# Altium schematic sheet Pg14_FPGA_DDR3.SchDoc: FPGA MEMORY -DDR2
size A2; DocumentNumber: 14; SheetNumber: 14; SheetTotal: 16
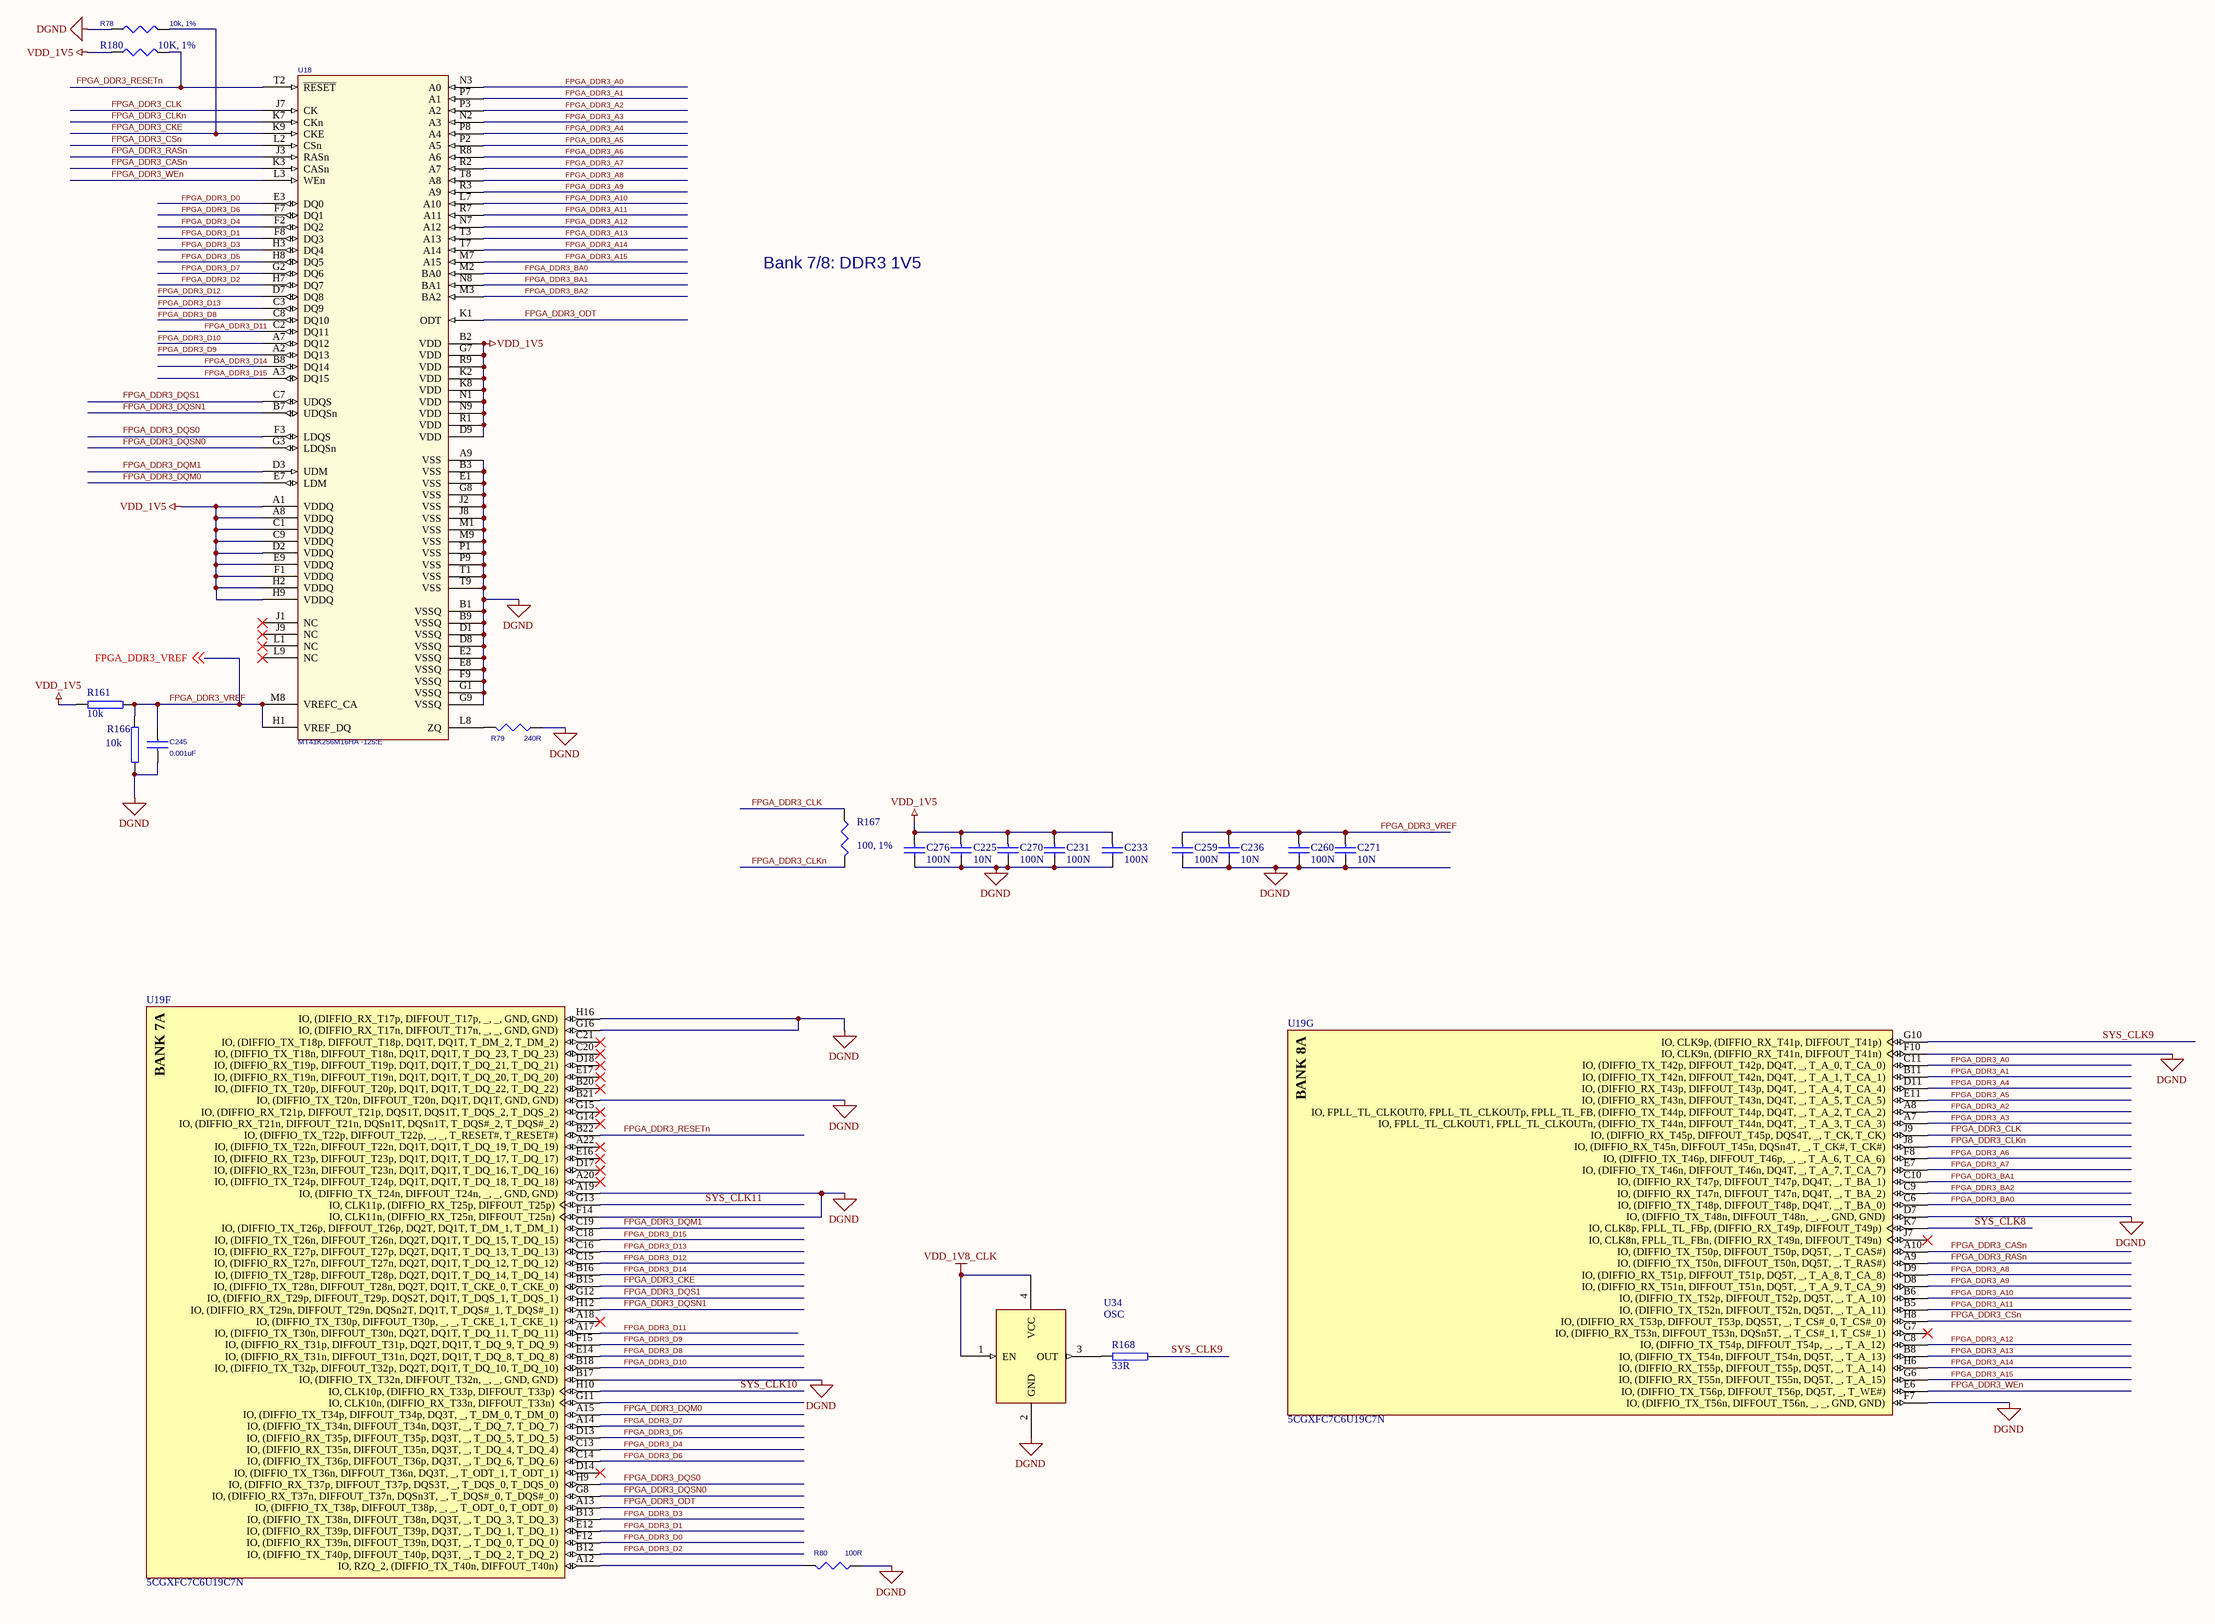
[diagram p0: Pg14_FPGA_DDR3.SchDoc]

## Parts
?  (no value)  (graphical)
C225  10N  [sc0402]
C231  100N  [sc0402]
C233  100N  [sc0402]
C236  10N  [sc0402]
C245  0.001uF  [SM-7351-CAP-0402]
C259  100N  [sc0402]
C260  100N  [0603]
C270  100N  [sc0402]
C271  10N  [sc0402]
C276  100N  [sc0402]
R78  10k, 1%  [sm-7351-res-0402 - duplicate]
R79  240R  [SM-7351-RES-0402]
R80  100R  [SM-7351-RES-0402]
R161  10k  [0603]
R166  10k  [0603]
R167  100, 1%  [sc0402]
R168  33R  [sc0402]
R180  10K, 1%  [sc0402]
U18  MT41K256M16HA -125:E  [BGA14X10-96]
U19  5CGXFC7C6U19C7N  [ALTR-UBGA484_A-190]  (parts F,G of 13)
U34  OSC  [Osc 3.2x2.5]

## Nets
DGND: C225.2 C231.2 C233.2 C236.2 C245.2 C259.2 C260.2 C270.2 C271.2 C276.2 R78.1 R79.2(P2) R80.2(P2) R166.2 U18.A9(VSS) U18.B1(VSSQ) U18.B3(VSS) U18.B9(VSSQ) U18.D1(VSSQ) U18.D8(VSSQ) U18.E1(VSS) U18.E2(VSSQ) U18.E8(VSSQ) U18.F9(VSSQ) U18.G1(VSSQ) U18.G8(VSS) U18.G9(VSSQ) U18.J2(VSS) U18.J8(VSS) U18.M1(VSS) U18.M9(VSS) U18.P1(VSS) U18.P9(VSS) U18.T1(VSS) U18.T9(VSS) U19.A19(IO,_(DIFFIO_TX_T24n,_DIFFOUT_T24n,__,__,_GND,_GND)) U19.B17(IO,_(DIFFIO_TX_T32n,_DIFFOUT_T32n,__,__,_GND,_GND)) U19.B21(IO,_(DIFFIO_TX_T20n,_DIFFOUT_T20n,_DQ1T,_DQ1T,_GND,_GND)) U19.D7(IO,_(DIFFIO_TX_T48n,_DIFFOUT_T48n,__,__,_GND,_GND)) U19.F7(IO,_(DIFFIO_TX_T56n,_DIFFOUT_T56n,__,__,_GND,_GND)) U19.F10(IO,_CLK9n,_(DIFFIO_RX_T41n,_DIFFOUT_T41n)) U19.F14(IO,_CLK11n,_(DIFFIO_RX_T25n,_DIFFOUT_T25n)) U19.G16(IO,_(DIFFIO_RX_T17n,_DIFFOUT_T17n,__,__,_GND,_GND)) U19.H16(IO,_(DIFFIO_RX_T17p,_DIFFOUT_T17p,__,__,_GND,_GND)) U34.2(GND)
VDD_1V5: C225.1 C231.1 C233.1 C270.1 C276.1 R161.1 R180.1 U18.A1(VDDQ) U18.A8(VDDQ) U18.B2(VDD) U18.C1(VDDQ) U18.C9(VDDQ) U18.D2(VDDQ) U18.D9(VDD) U18.E9(VDDQ) U18.F1(VDDQ) U18.G7(VDD) U18.H2(VDDQ) U18.H9(VDDQ) U18.K2(VDD) U18.K8(VDD) U18.N1(VDD) U18.N9(VDD) U18.R1(VDD) U18.R9(VDD)
VDD_1V8_CLK: U34.1(EN) U34.4(VCC)
FPGA_DDR3_A0: U18.N3(A0) U19.C11(IO,_(DIFFIO_TX_T42p,_DIFFOUT_T42p,_DQ4T,__,_T_A_0,_T_CA_0))
FPGA_DDR3_A1: U18.P7(A1) U19.B11(IO,_(DIFFIO_TX_T42n,_DIFFOUT_T42n,_DQ4T,__,_T_A_1,_T_CA_1))
FPGA_DDR3_A2: U18.P3(A2) U19.A8(IO,_FPLL_TL_CLKOUT0,_FPLL_TL_CLKOUTp,_FPLL_TL_FB,_(DIFFIO_TX_T44p,_DIFFOUT_T44p,_DQ4T,__,_T_A_2,_T_CA_2))
FPGA_DDR3_A3: U18.N2(A3) U19.A7(IO,_FPLL_TL_CLKOUT1,_FPLL_TL_CLKOUTn,_(DIFFIO_TX_T44n,_DIFFOUT_T44n,_DQ4T,__,_T_A_3,_T_CA_3))
FPGA_DDR3_A4: U18.P8(A4) U19.D11(IO,_(DIFFIO_RX_T43p,_DIFFOUT_T43p,_DQ4T,__,_T_A_4,_T_CA_4))
FPGA_DDR3_A5: U18.P2(A5) U19.E11(IO,_(DIFFIO_RX_T43n,_DIFFOUT_T43n,_DQ4T,__,_T_A_5,_T_CA_5))
FPGA_DDR3_A6: U18.R8(A6) U19.F8(IO,_(DIFFIO_TX_T46p,_DIFFOUT_T46p,__,__,_T_A_6,_T_CA_6))
FPGA_DDR3_A7: U18.R2(A7) U19.E7(IO,_(DIFFIO_TX_T46n,_DIFFOUT_T46n,_DQ4T,__,_T_A_7,_T_CA_7))
FPGA_DDR3_A8: U18.T8(A8) U19.D9(IO,_(DIFFIO_RX_T51p,_DIFFOUT_T51p,_DQ5T,__,_T_A_8,_T_CA_8))
FPGA_DDR3_A9: U18.R3(A9) U19.D8(IO,_(DIFFIO_RX_T51n,_DIFFOUT_T51n,_DQ5T,__,_T_A_9,_T_CA_9))
FPGA_DDR3_A10: U18.L7(A10) U19.B6(IO,_(DIFFIO_TX_T52p,_DIFFOUT_T52p,_DQ5T,__,_T_A_10))
FPGA_DDR3_A11: U18.R7(A11) U19.B5(IO,_(DIFFIO_TX_T52n,_DIFFOUT_T52n,_DQ5T,__,_T_A_11))
FPGA_DDR3_A12: U18.N7(A12) U19.C8(IO,_(DIFFIO_TX_T54p,_DIFFOUT_T54p,__,__,_T_A_12))
FPGA_DDR3_A13: U18.T3(A13) U19.B8(IO,_(DIFFIO_TX_T54n,_DIFFOUT_T54n,_DQ5T,__,_T_A_13))
FPGA_DDR3_A14: U18.T7(A14) U19.H6(IO,_(DIFFIO_RX_T55p,_DIFFOUT_T55p,_DQ5T,__,_T_A_14))
FPGA_DDR3_A15: U18.M7(A15) U19.G6(IO,_(DIFFIO_RX_T55n,_DIFFOUT_T55n,_DQ5T,__,_T_A_15))
FPGA_DDR3_BA0: U18.M2(BA0) U19.C6(IO,_(DIFFIO_TX_T48p,_DIFFOUT_T48p,_DQ4T,__,_T_BA_0))
FPGA_DDR3_BA1: U18.N8(BA1) U19.C10(IO,_(DIFFIO_RX_T47p,_DIFFOUT_T47p,_DQ4T,__,_T_BA_1))
FPGA_DDR3_BA2: U18.M3(BA2) U19.C9(IO,_(DIFFIO_RX_T47n,_DIFFOUT_T47n,_DQ4T,__,_T_BA_2))
FPGA_DDR3_CASn: U18.K3(CASn) U19.A10(IO,_(DIFFIO_TX_T50p,_DIFFOUT_T50p,_DQ5T,__,_T_CAS#))
FPGA_DDR3_CKE: R78.2 U18.K9(CKE) U19.B15(IO,_(DIFFIO_TX_T28n,_DIFFOUT_T28n,_DQ2T,_DQ1T,_T_CKE_0,_T_CKE_0))
FPGA_DDR3_CLK: R167.1 U18.J7(CK) U19.J9(IO,_(DIFFIO_RX_T45p,_DIFFOUT_T45p,_DQS4T,__,_T_CK,_T_CK))
FPGA_DDR3_CLKn: R167.2 U18.K7(CKn) U19.J8(IO,_(DIFFIO_RX_T45n,_DIFFOUT_T45n,_DQSn4T,__,_T_CK#,_T_CK#))
FPGA_DDR3_CSn: U18.L2(CSn) U19.H8(IO,_(DIFFIO_RX_T53p,_DIFFOUT_T53p,_DQS5T,__,_T_CS#_0,_T_CS#_0))
FPGA_DDR3_D0: U18.E3(DQ0) U19.F12(IO,_(DIFFIO_RX_T39n,_DIFFOUT_T39n,_DQ3T,__,_T_DQ_0,_T_DQ_0))
FPGA_DDR3_D1: U18.F8(DQ3) U19.E12(IO,_(DIFFIO_RX_T39p,_DIFFOUT_T39p,_DQ3T,__,_T_DQ_1,_T_DQ_1))
FPGA_DDR3_D2: U18.H7(DQ7) U19.B12(IO,_(DIFFIO_TX_T40p,_DIFFOUT_T40p,_DQ3T,__,_T_DQ_2,_T_DQ_2))
FPGA_DDR3_D3: U18.H3(DQ4) U19.B13(IO,_(DIFFIO_TX_T38n,_DIFFOUT_T38n,_DQ3T,__,_T_DQ_3,_T_DQ_3))
FPGA_DDR3_D4: U18.F2(DQ2) U19.C13(IO,_(DIFFIO_RX_T35n,_DIFFOUT_T35n,_DQ3T,__,_T_DQ_4,_T_DQ_4))
FPGA_DDR3_D5: U18.H8(DQ5) U19.D13(IO,_(DIFFIO_RX_T35p,_DIFFOUT_T35p,_DQ3T,__,_T_DQ_5,_T_DQ_5))
FPGA_DDR3_D6: U18.F7(DQ1) U19.C14(IO,_(DIFFIO_TX_T36p,_DIFFOUT_T36p,_DQ3T,__,_T_DQ_6,_T_DQ_6))
FPGA_DDR3_D7: U18.G2(DQ6) U19.A14(IO,_(DIFFIO_TX_T34n,_DIFFOUT_T34n,_DQ3T,__,_T_DQ_7,_T_DQ_7))
FPGA_DDR3_D8: U18.C8(DQ10) U19.E14(IO,_(DIFFIO_RX_T31n,_DIFFOUT_T31n,_DQ2T,_DQ1T,_T_DQ_8,_T_DQ_8))
FPGA_DDR3_D9: U18.A2(DQ13) U19.F15(IO,_(DIFFIO_RX_T31p,_DIFFOUT_T31p,_DQ2T,_DQ1T,_T_DQ_9,_T_DQ_9))
FPGA_DDR3_D10: U18.A7(DQ12) U19.B18(IO,_(DIFFIO_TX_T32p,_DIFFOUT_T32p,_DQ2T,_DQ1T,_T_DQ_10,_T_DQ_10))
FPGA_DDR3_D11: U18.C2(DQ11) U19.A17(IO,_(DIFFIO_TX_T30n,_DIFFOUT_T30n,_DQ2T,_DQ1T,_T_DQ_11,_T_DQ_11))
FPGA_DDR3_D12: U18.D7(DQ8) U19.C15(IO,_(DIFFIO_RX_T27n,_DIFFOUT_T27n,_DQ2T,_DQ1T,_T_DQ_12,_T_DQ_12))
FPGA_DDR3_D13: U18.C3(DQ9) U19.C16(IO,_(DIFFIO_RX_T27p,_DIFFOUT_T27p,_DQ2T,_DQ1T,_T_DQ_13,_T_DQ_13))
FPGA_DDR3_D14: U18.B8(DQ14) U19.B16(IO,_(DIFFIO_TX_T28p,_DIFFOUT_T28p,_DQ2T,_DQ1T,_T_DQ_14,_T_DQ_14))
FPGA_DDR3_D15: U18.A3(DQ15) U19.C18(IO,_(DIFFIO_TX_T26n,_DIFFOUT_T26n,_DQ2T,_DQ1T,_T_DQ_15,_T_DQ_15))
FPGA_DDR3_DQM0: U18.E7(LDM) U19.A15(IO,_(DIFFIO_TX_T34p,_DIFFOUT_T34p,_DQ3T,__,_T_DM_0,_T_DM_0))
FPGA_DDR3_DQM1: U18.D3(UDM) U19.C19(IO,_(DIFFIO_TX_T26p,_DIFFOUT_T26p,_DQ2T,_DQ1T,_T_DM_1,_T_DM_1))
FPGA_DDR3_DQS0: U18.F3(LDQS) U19.H9(IO,_(DIFFIO_RX_T37p,_DIFFOUT_T37p,_DQS3T,__,_T_DQS_0,_T_DQS_0))
FPGA_DDR3_DQS1: U18.C7(UDQS) U19.G12(IO,_(DIFFIO_RX_T29p,_DIFFOUT_T29p,_DQS2T,_DQ1T,_T_DQS_1,_T_DQS_1))
FPGA_DDR3_DQSN0: U18.G3(LDQSn) U19.G8(IO,_(DIFFIO_RX_T37n,_DIFFOUT_T37n,_DQSn3T,__,_T_DQS#_0,_T_DQS#_0))
FPGA_DDR3_DQSN1: U18.B7(UDQSn) U19.H12(IO,_(DIFFIO_RX_T29n,_DIFFOUT_T29n,_DQSn2T,_DQ1T,_T_DQS#_1,_T_DQS#_1))
FPGA_DDR3_ODT: U18.K1(ODT) U19.A13(IO,_(DIFFIO_TX_T38p,_DIFFOUT_T38p,__,__,_T_ODT_0,_T_ODT_0))
FPGA_DDR3_RASn: U18.J3(RASn) U19.A9(IO,_(DIFFIO_TX_T50n,_DIFFOUT_T50n,_DQ5T,__,_T_RAS#))
FPGA_DDR3_RESETn: R180.2 U18.T2(~{RESET}) U19.B22(IO,_(DIFFIO_TX_T22p,_DIFFOUT_T22p,__,__,_T_RESET#,_T_RESET#))
FPGA_DDR3_VREF: C236.1 C245.1 C259.1 C260.1 C271.1 R161.2 R166.1 U18.H1(VREF_DQ) U18.M8(VREFC_CA) ; off-sheet FPGA_DDR3_VREF
FPGA_DDR3_WEn: U18.L3(WEn) U19.E6(IO,_(DIFFIO_TX_T56p,_DIFFOUT_T56p,_DQ5T,__,_T_WE#))
SYS_CLK8: U19.K7(IO,_CLK8p,_FPLL_TL_FBp,_(DIFFIO_RX_T49p,_DIFFOUT_T49p))
SYS_CLK9: R168.2 U19.G10(IO,_CLK9p,_(DIFFIO_RX_T41p,_DIFFOUT_T41p))
SYS_CLK10: U19.H10(IO,_CLK10p,_(DIFFIO_RX_T33p,_DIFFOUT_T33p))
SYS_CLK11: U19.G13(IO,_CLK11p,_(DIFFIO_RX_T25p,_DIFFOUT_T25p))
NetR79_1: R79.1(P1) U18.L8(ZQ)
NetR80_1: R80.1(P1) U19.A12(IO,_RZQ_2,_(DIFFIO_TX_T40n,_DIFFOUT_T40n))
NetR168_1: R168.1 U34.3(OUT)

Not connected (* = marked no-connect by the designer): U18 J1(NC)* J9(NC)* L1(NC)* L9(NC)*; U19 A18(IO,_(DIFFIO_TX_T30p,_DIFFOUT_T30p,__,__,_T_CKE_1,_T_CKE_1))* A20(IO,_(DIFFIO_TX_T24p,_DIFFOUT_T24p,_DQ1T,_DQ1T,_T_DQ_18,_T_DQ_18))* A22(IO,_(DIFFIO_TX_T22n,_DIFFOUT_T22n,_DQ1T,_DQ1T,_T_DQ_19,_T_DQ_19))* B20(IO,_(DIFFIO_TX_T20p,_DIFFOUT_T20p,_DQ1T,_DQ1T,_T_DQ_22,_T_DQ_22))* C20(IO,_(DIFFIO_TX_T18n,_DIFFOUT_T18n,_DQ1T,_DQ1T,_T_DQ_23,_T_DQ_23))* C21(IO,_(DIFFIO_TX_T18p,_DIFFOUT_T18p,_DQ1T,_DQ1T,_T_DM_2,_T_DM_2))* D14(IO,_(DIFFIO_TX_T36n,_DIFFOUT_T36n,_DQ3T,__,_T_ODT_1,_T_ODT_1))* D17(IO,_(DIFFIO_RX_T23n,_DIFFOUT_T23n,_DQ1T,_DQ1T,_T_DQ_16,_T_DQ_16))* D18(IO,_(DIFFIO_RX_T19p,_DIFFOUT_T19p,_DQ1T,_DQ1T,_T_DQ_21,_T_DQ_21))* E16(IO,_(DIFFIO_RX_T23p,_DIFFOUT_T23p,_DQ1T,_DQ1T,_T_DQ_17,_T_DQ_17))* E17(IO,_(DIFFIO_RX_T19n,_DIFFOUT_T19n,_DQ1T,_DQ1T,_T_DQ_20,_T_DQ_20))* G7(IO,_(DIFFIO_RX_T53n,_DIFFOUT_T53n,_DQSn5T,__,_T_CS#_1,_T_CS#_1))* G11(IO,_CLK10n,_(DIFFIO_RX_T33n,_DIFFOUT_T33n)) G14(IO,_(DIFFIO_RX_T21n,_DIFFOUT_T21n,_DQSn1T,_DQSn1T,_T_DQS#_2,_T_DQS#_2))* G15(IO,_(DIFFIO_RX_T21p,_DIFFOUT_T21p,_DQS1T,_DQS1T,_T_DQS_2,_T_DQS_2))* J7(IO,_CLK8n,_FPLL_TL_FBn,_(DIFFIO_RX_T49n,_DIFFOUT_T49n))*

## Notes on the sheet
- Bank 7/8: DDR3 1V5
- Embedded Vision Systems Group
- Title
- School of Electrical and Electronic Engineering
- Date:
- Size
- Document Number
- Sheet
- of
- Rev
- (in symbol 5CGXFC7C6U19C7N, part F) BANK 7A
- (in symbol 5CGXFC7C6U19C7N, part G) BANK 8A

## Library data of the parts
? = Title Block Address(1): UoM title block
C225 C231 C233 C236 C259 C260 C270 C271 C276 = CAP: NON-POLARISED CAP
C245 = 0.001uFCapacitor50V5%0402: Mfr: AVX; PartName: 0.001uF50V5%SMD0402; MfrNum: 04025C102JAT2A; TIIntPartnumber: 1C0093; PN: 0402YC103KAT2A; TN: 207-0054-000; Vendor: Digikey; Cost100: 0.015; Cost10K: 0.007; DescriptiveText: Capacitor 0.001uF 50V 5% 0402
R78 = RES_10K_1/16W_1%_0402: RES 10K OHM 1/16W 5% 0402 SMD; Manufacturer: Rohm Semiconductor; Manufacturer Part Number: MCR01MZPJ103; Power (Watts): 0.063W, 1/16W; Temperature Coefficient: ±200ppm/°C; Category: Resistors; ComponentLink1Description: http://rohmfs.rohm.com/en/products/databook/datasheet/passive/resistor/chip_resistor/mcr_a.pdf; ComponentLink1URL: http://rohmfs.rohm.com/en/products/databook/datasheet/passive/resistor/chip_resistor/mcr_a.pdf; Composition: Thick Film; Features: Automotive AEC-Q200 Qualified; Height: 0.016" (0.40mm); Number of Terminations: 2; Package / Case: 0402 (1005 Metric); Packaging: Digi-Reel®; Pricing 1: 1=0.1, 10=0.019, 25=0.014, 100=0.0078, 250=0.00596, 500=0.00476, 1000=0.0035, 5000=0.00251 (USD); Resistance (Ohms): 10k; RoHS: RoHS Compliant; Size / Dimension: 0.039" L x 0.020" W (1.00mm x 0.50mm); Stock 1: 110842; Supplier 1: Digi-Key; Supplier Device Package: 0402 (1005 Metric); Supplier Part Number 1: RHM10KJDKR-ND; Tolerance: ±5%
R79 R80 = 10KOhmResistor1/16W0402: Resistor 10Kohm 1/16W 5% 0402; PartName: 10Kohm1/16W5%SMD0402; Mfr: Rohm; MfrNum: MCR01MZPJ103; TIIntPartnumber: 1R0168; Vendor: DIGIKEY; Cost100: 0.03; Cost10K: 0.0017; DescriptiveText: Resistor 10Kohm 1/16W 5% 0402; Descriptive_Text: Resistor 10Kohm 1/16W 5% 0402
R161 R166 = RES: RESISTOR
R167 = RESISTOR
R168 = RES: Resistor
R180 = RES_10K_1/16W_1%_0402: RES 1.50K OHM 1/16W 1% 0402 SMD; Manufacturer: Yageo; Manufacturer Part Number: RC0402FR-071K5L; Resistance (Ohms): 1.5k; Power (Watts): 0.063W, 1/16W; Temperature Coefficient: ±100ppm/°C; Supplier 1: Digi-Key; Supplier Part Number 1: 311-1.50KLRDKR-ND; RoHS: RoHS Compliant; Category: Resistors; Stock 1: 433921; Pricing 1: 1=0.1, 10=0.014, 25=0.0104, 100=0.0063, 250=0.0054, 500=0.00382, 1000=0.0027, 2500=0.00234, 5000=0.00203 (USD); Composition: Thick Film; Features: -; Tolerance: ±1%; Package / Case: 0402 (1005 Metric); Supplier Device Package: 0402; Size / Dimension: 0.039" L x 0.020" W (1.00mm x 0.50mm); Height: 0.016" (0.40mm); Number of Terminations: 2; Packaging: Digi-Reel®; ComponentLink1URL: http://www.yageo.com/documents/recent/PYu-RC0402_51_RoHS_L_6.pdf; ComponentLink1Description: http://www.yageo.com/documents/recent/PYu-RC0402_51_RoHS_L_6.pdf
U18 = MT41K256M16HA: DDR2 SDRAM 2Gb (256Mx8); Manufacturer: Micron Technology; Lead Time: 0 weeks; Peak Solder Temperature: 260 deg C; Supplier 1: Arrow; Supplier Part Number 1: 52128708S9959891N2406; Manufacturer Part Number: MT41K256M16HA-125:E; RoHS: CHINA ROHS: Compliant / EU ROHS: Compliant; Stock 1: 0; Pricing 1: 0=10.09 (USD); Package Quantity: 1; Termination Finish: Sn/Ag/Cu; China ROHS Lead (X -> above / O -> below threshold): O; China ROHS Mercury (X -> above / O -> below threshold): O; China ROHS Cadmium (X -> above / O -> below threshold): O; China ROHS Hex Chromium (X -> above / O -> below threshold): O; China ROHS PBB (X -> above / O -> below threshold): O; China ROHS PBDE (X -> above / O -> below threshold): O; EU_ROHS_PROD_EXEMPTION_BY_SUPP: N/R; ComponentLink1URL: http://components.arrow.com/partservice/dataview/altium/52128708S9959891N2406?apiKey=aa438727d59eed98c4bed826d8d949c84cb5e685b92bf87346a0226bd2658797; ComponentLink1Description: http://components.arrow.com/partservice/dataview/altium/52128708S9959891N2406?apiKey=aa438727d59eed98c4bed826d8d949c84cb5e685b92bf87346a0226bd2658797
U19 = 5CGXFC7C6U19C7N: Cyclone V GX Family FPGA, 1.07 to 1.13 V Supply, 240 I/O Pins, 7 PLLs, 484-Pin UBGA, Speed Grade 7, Commercial Grade, RoHS Compliant; Manufacturer: Altera; GPIO: 240; Logic Elements (LE) (K): 149.5; Speed Grade: 7; DatasheetVersion: Rev. 3.4; PackageVersion: Rev. 1.0, 12/2011; PackageReference: UBGA484_A-190; PackageDescription: 484-Pin Ultra FineLine Ball-Grid Array (UBGA), Body 19 x 19 mm, Pitch 0.8 mm; Supplier 1: Digi-Key; Supplier Part Number 1: 5CGXFC7C6U19C7N-ND; Supplier 2: Mouser; Supplier Part Number 2: 989-5CGXFC7C6U19C7N; Device Group: 5CGXFC7; RoHS: RoHS Compliant; Subcategory: Cyclone V GX; Voltage Supply: 1.07 to 1.13 V; NexusDeviceID: 5CGXFC7C6U19C7N; Mounting Technology: Surface Mount; Code_JEDEC: MO-275-PPAA-2; PartNumber: 5CGXFC7C6U19C7N; ComponentLink1Description: Manufacturer URL; ComponentLink1URL: http://www.altera.com; ComponentLink2Description: Datasheet; ComponentLink2URL: http://www.altera.com/literature/hb/cyclone-v/cv_51002.pdf; ComponentLink3Description: Package Specification; ComponentLink3URL: http://www.altera.com/devicepackaging/04R00436-01.pdf; ComponentLink4Description: Device Handbook URL; ComponentLink4URL: http://www.altera.com/literature/hb/cyclone-v/cyclone5_handbook.pdf; ComponentLink5Description: Device Pin-Out URL; ComponentLink5URL: http://www.altera.com/literature/dp/cyclone-v/5CGXFC7.xls; ComponentLink6Description: Device Overview URL; ComponentLink6URL: http://www.altera.com/literature/hb/cyclone-v/cv_51001.pdf; ComponentLink7Description: Product URL; ComponentLink7URL: http://www.buyaltera.com/scripts/partsearch.dll?Detail&name=5CGXFC7C6U19C7N-ND
U34 = OSC: XTAL OSCILLATOR MODULE